# EAGLE schematic Enclosure 130x95 BPM-L (EAGLE 9.6.2)
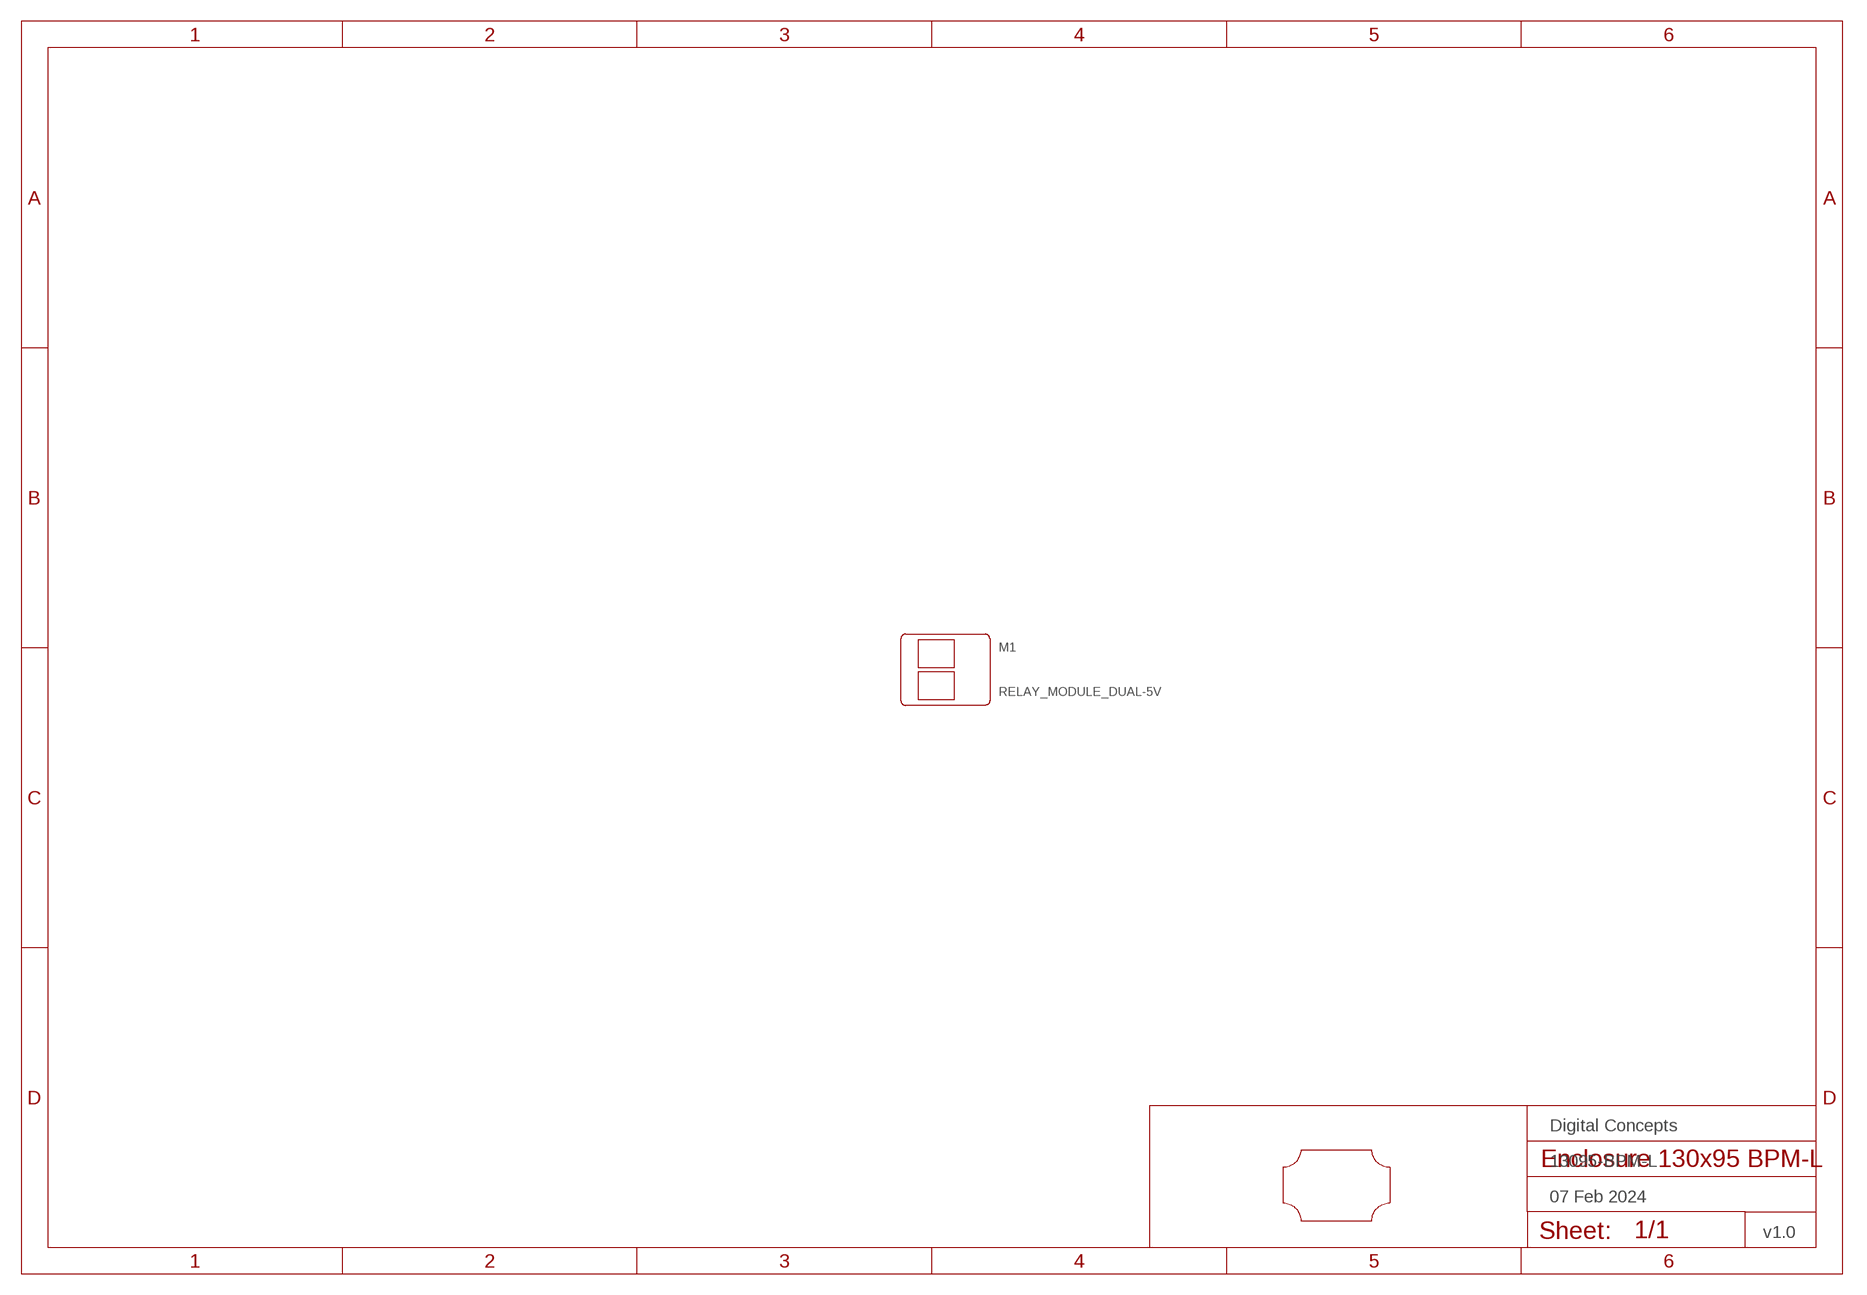
[diagram p0: schematic, sheet 1]
FRAME1 (FRAME-A4L-LOC): DATE: 07 Feb 2024; OWNER: Digital Concepts; TITLE: 13095-BPM-L; VERSION: v1.0

## Parts
M1  RELAY_MODULE_DUAL-5V  [RELAY-MODULE-DUAL-5V]
U$1  PCB-OUTLINE-130X95-MAX-LCM-H3  [PROTO-130X95-OUTLINE-MAX-LCM-H3]

## Library data of the parts
M1 = digitalconcepts:RELAY_MODULE_DUAL-5V: Dual Relay Module (5V)
U$1 = digitalconcepts:PCB-OUTLINE-130X95-MAX-LCM-H3: PCB Eagle Max-Left-Cropped outline for 130 x 95 enclosure (Horizontal format)